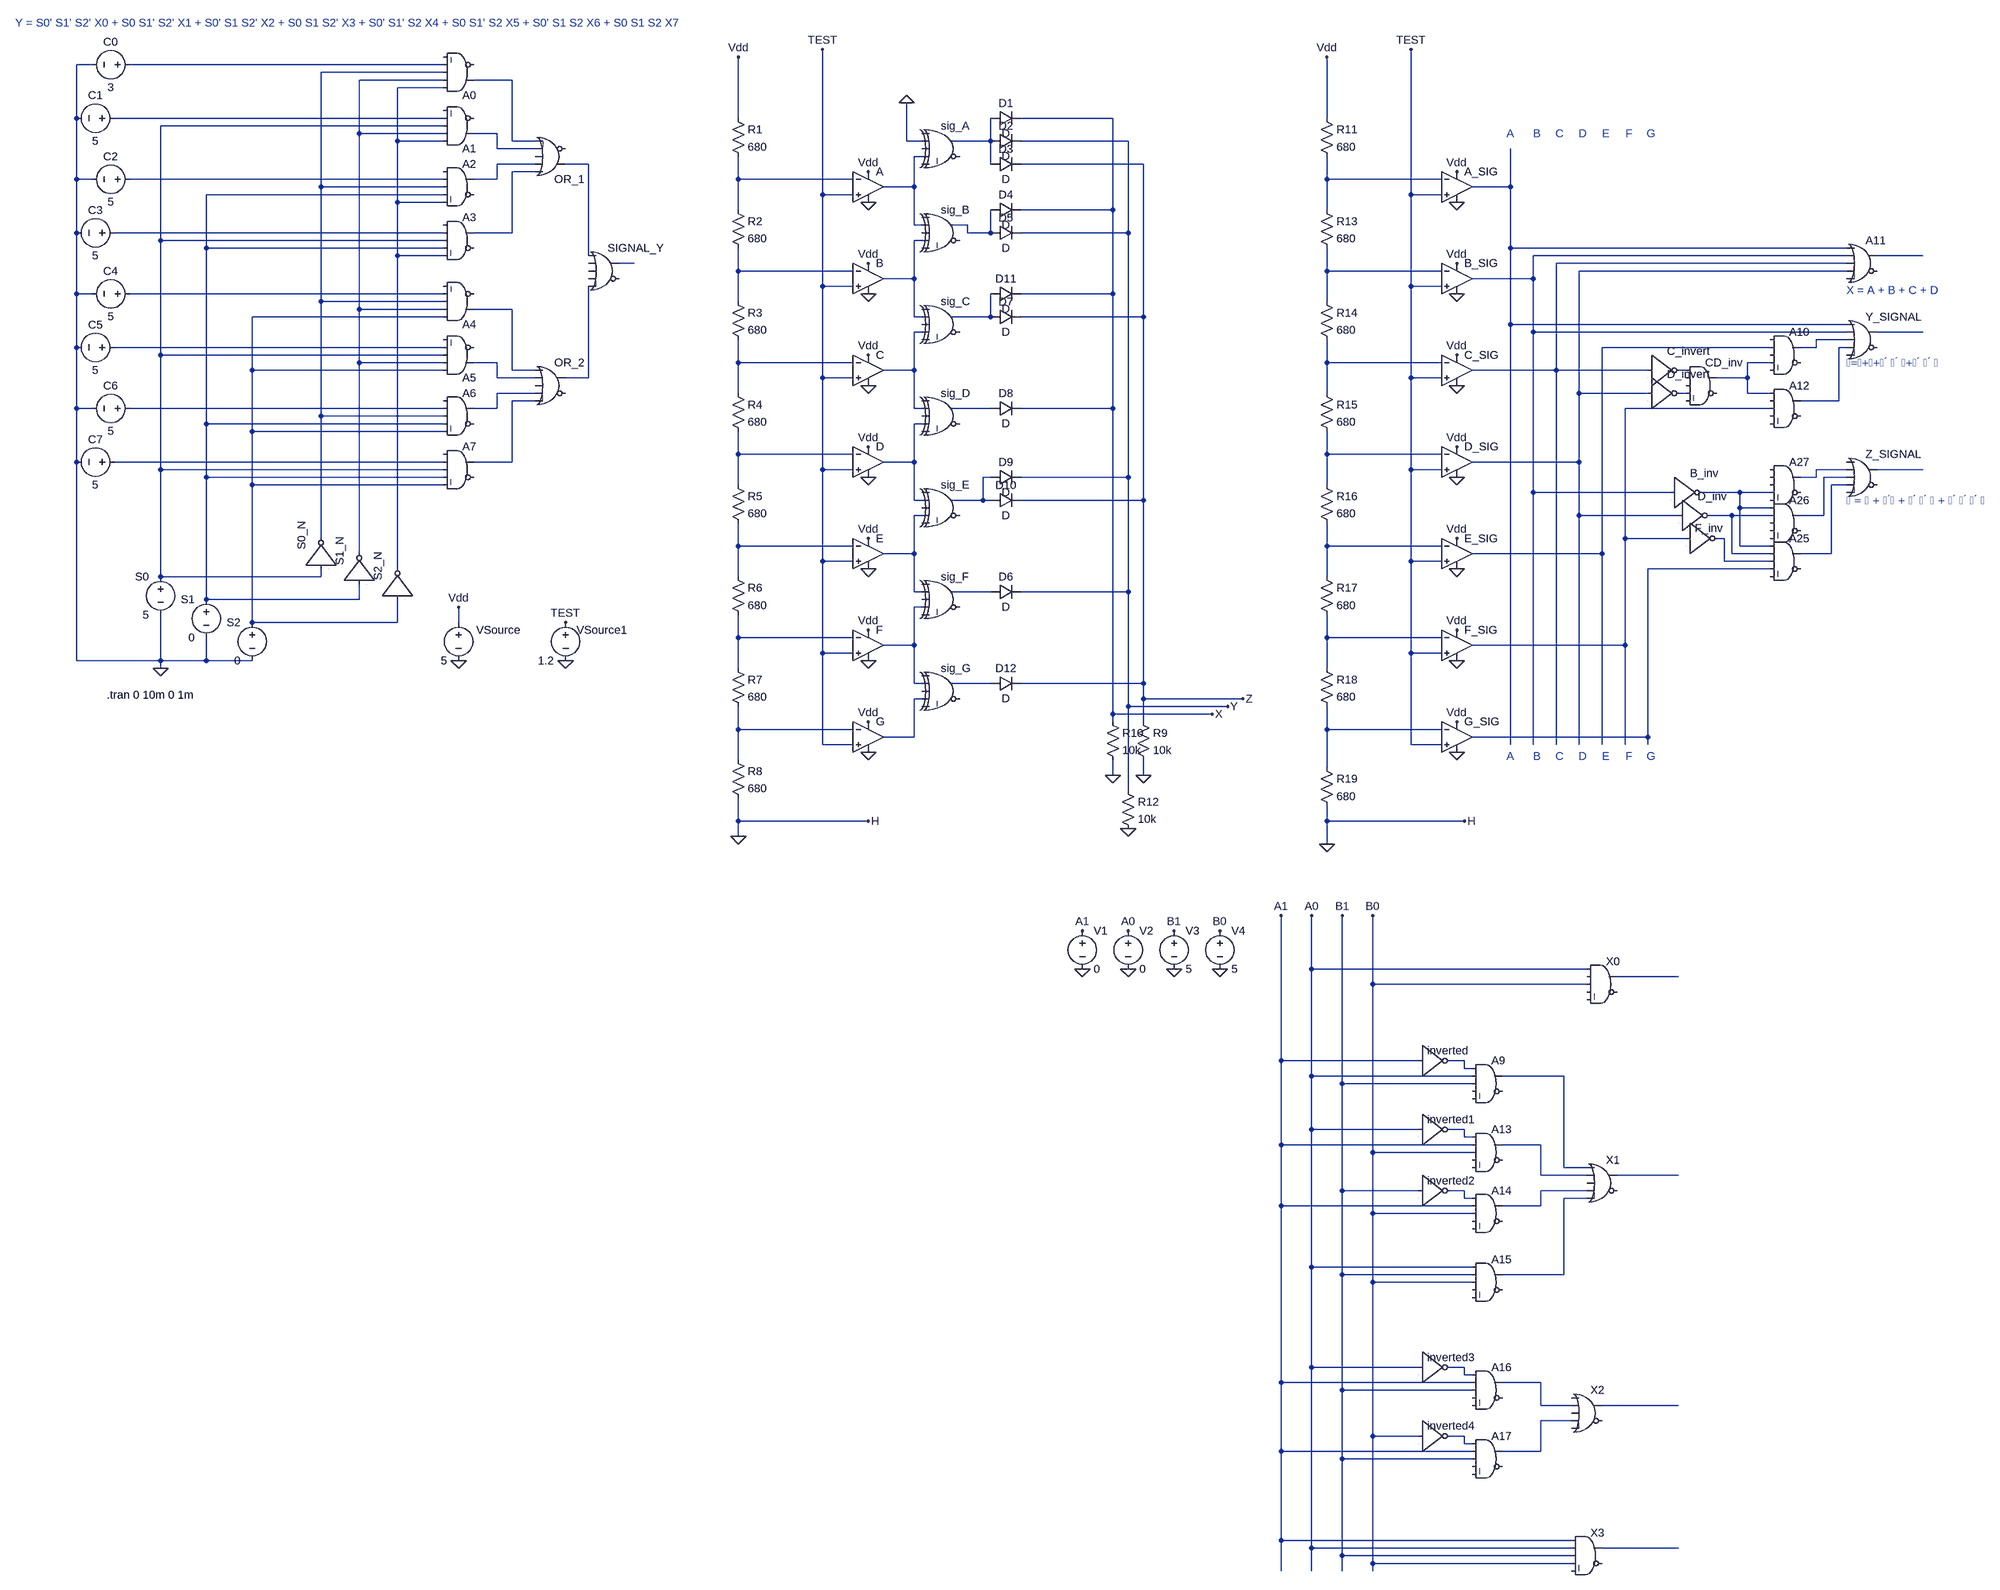
[diagram p0: schematic ALL SCHEMATICS.asc]
ALL SCHEMATICS.asc, the LTspice schematic file:
Version 4
SHEET 1 4152 3384
WIRE -512 48 -544 48
WIRE 224 48 -432 48
WIRE 224 64 -32 64
WIRE 224 80 48 80
WIRE 368 80 288 80
WIRE 224 96 128 96
WIRE -544 160 -544 48
WIRE 224 160 -464 160
WIRE 880 160 880 32
WIRE 1664 160 1472 160
WIRE 2112 160 2112 32
WIRE 224 176 -368 176
WIRE 48 192 48 80
WIRE 224 192 48 192
WIRE 336 192 288 192
WIRE 128 208 128 96
WIRE 224 208 128 208
WIRE 368 208 368 80
WIRE 416 208 368 208
WIRE 1232 208 1232 128
WIRE 1264 208 1232 208
WIRE 1408 208 1408 160
WIRE 1408 208 1328 208
WIRE 1696 208 1472 208
WIRE 336 224 336 192
WIRE 416 224 336 224
WIRE 1264 240 1248 240
WIRE 416 256 336 256
WIRE 528 256 480 256
WIRE 1408 256 1408 208
WIRE 1728 256 1472 256
WIRE 416 272 368 272
WIRE -544 288 -544 160
WIRE -512 288 -544 288
WIRE 224 288 -432 288
WIRE 336 288 336 256
WIRE 336 288 288 288
WIRE 880 288 880 240
WIRE 1120 288 880 288
WIRE 2112 288 2112 240
WIRE 2352 288 2112 288
WIRE -32 304 -32 64
WIRE 224 304 -32 304
WIRE 1248 304 1248 240
WIRE 1248 304 1184 304
WIRE 2496 304 2496 224
WIRE 2496 304 2416 304
WIRE 224 320 -272 320
WIRE 1056 320 1056 16
WIRE 1120 320 1056 320
WIRE 2288 320 2288 16
WIRE 2352 320 2288 320
WIRE 128 336 128 208
WIRE 224 336 128 336
WIRE 880 352 880 288
WIRE 1664 352 1664 160
WIRE 1664 352 1472 352
WIRE 2112 352 2112 288
WIRE 1248 384 1248 304
WIRE 1264 384 1248 384
WIRE 1360 384 1328 384
WIRE -544 400 -544 288
WIRE 224 400 -464 400
WIRE 368 400 368 272
WIRE 368 400 288 400
WIRE 1360 400 1360 384
WIRE 1408 400 1408 352
WIRE 1408 400 1360 400
WIRE 1696 400 1696 208
WIRE 1696 400 1472 400
WIRE -368 416 -368 176
WIRE 224 416 -368 416
WIRE 1264 416 1248 416
WIRE -272 432 -272 320
WIRE 224 432 -272 432
WIRE 2496 432 2496 304
WIRE 3200 432 2496 432
WIRE 128 448 128 336
WIRE 224 448 128 448
WIRE 528 448 528 256
WIRE 3200 448 2544 448
WIRE 3360 448 3264 448
WIRE 624 464 592 464
WIRE 3200 464 2592 464
WIRE 880 480 880 432
WIRE 1120 480 880 480
WIRE 2112 480 2112 432
WIRE 2352 480 2112 480
WIRE 3200 480 2640 480
WIRE 1248 496 1248 416
WIRE 1248 496 1184 496
WIRE 2544 496 2544 448
WIRE 2544 496 2416 496
WIRE 1056 512 1056 320
WIRE 1120 512 1056 512
WIRE 2288 512 2288 320
WIRE 2352 512 2288 512
WIRE -544 528 -544 400
WIRE -512 528 -544 528
WIRE 224 528 -432 528
WIRE 1664 528 1664 352
WIRE 1664 528 1472 528
WIRE -32 544 -32 304
WIRE 224 544 -32 544
WIRE 880 544 880 480
WIRE 2112 544 2112 480
WIRE 48 560 48 192
WIRE 224 560 48 560
WIRE 368 560 288 560
WIRE 224 576 -176 576
WIRE 1248 576 1248 496
WIRE 1264 576 1248 576
WIRE 1408 576 1408 528
WIRE 1408 576 1328 576
WIRE 1728 576 1728 256
WIRE 1728 576 1472 576
WIRE 2496 592 2496 432
WIRE 3200 592 2496 592
WIRE 1264 608 1248 608
WIRE 2544 608 2544 496
WIRE 3200 608 2544 608
WIRE 3360 608 3264 608
WIRE 3200 624 3136 624
WIRE -544 640 -544 528
WIRE 224 640 -464 640
WIRE 3040 640 2688 640
WIRE 3136 640 3136 624
WIRE 3136 640 3104 640
WIRE 3200 640 3184 640
WIRE -368 656 -368 416
WIRE 224 656 -368 656
WIRE 48 672 48 560
WIRE 224 672 48 672
WIRE 336 672 288 672
WIRE 880 672 880 624
WIRE 1120 672 880 672
WIRE 2112 672 2112 624
WIRE 2352 672 2112 672
WIRE 3040 672 2992 672
WIRE -176 688 -176 576
WIRE 224 688 -176 688
WIRE 368 688 368 560
WIRE 416 688 368 688
WIRE 1248 688 1248 608
WIRE 1248 688 1184 688
WIRE 2592 688 2592 464
WIRE 2592 688 2416 688
WIRE 2784 688 2592 688
WIRE 2864 688 2848 688
WIRE 336 704 336 672
WIRE 416 704 336 704
WIRE 528 704 528 512
WIRE 528 704 480 704
WIRE 1056 704 1056 512
WIRE 1120 704 1056 704
WIRE 2288 704 2288 512
WIRE 2352 704 2288 704
WIRE 2992 704 2992 672
WIRE 2992 704 2928 704
WIRE 416 736 336 736
WIRE 880 736 880 672
WIRE 2112 736 2112 672
WIRE 2640 736 2640 480
WIRE 2784 736 2640 736
WIRE 2864 736 2848 736
WIRE 2992 736 2992 704
WIRE 3040 736 2992 736
WIRE 416 752 368 752
WIRE 3184 752 3184 640
WIRE 3184 752 3104 752
WIRE -544 768 -544 640
WIRE -512 768 -544 768
WIRE 224 768 -432 768
WIRE 336 768 336 736
WIRE 336 768 288 768
WIRE 1248 768 1248 688
WIRE 1264 768 1248 768
WIRE 1408 768 1328 768
WIRE 1664 768 1664 528
WIRE 1664 768 1472 768
WIRE 3040 768 2736 768
WIRE -32 784 -32 544
WIRE 224 784 -32 784
WIRE -272 800 -272 432
WIRE 224 800 -272 800
WIRE 1264 800 1248 800
WIRE -176 816 -176 688
WIRE 224 816 -176 816
WIRE 880 864 880 816
WIRE 1120 864 880 864
WIRE 2112 864 2112 816
WIRE 2352 864 2112 864
WIRE -544 880 -544 768
WIRE 224 880 -464 880
WIRE 368 880 368 752
WIRE 368 880 288 880
WIRE 1248 880 1248 800
WIRE 1248 880 1184 880
WIRE 2640 880 2640 736
WIRE 2640 880 2416 880
WIRE -368 896 -368 656
WIRE 224 896 -368 896
WIRE 1056 896 1056 704
WIRE 1120 896 1056 896
WIRE 2288 896 2288 704
WIRE 2352 896 2288 896
WIRE 3200 896 3136 896
WIRE 3360 896 3264 896
WIRE -272 912 -272 800
WIRE 224 912 -272 912
WIRE 1408 912 1392 912
WIRE 1696 912 1696 400
WIRE 1696 912 1472 912
WIRE 3136 912 3136 896
WIRE 3136 912 3104 912
WIRE 3200 912 3152 912
WIRE -176 928 -176 816
WIRE 224 928 -176 928
WIRE 880 928 880 864
WIRE 2112 928 2112 864
WIRE 3200 928 3168 928
WIRE 2544 944 2544 608
WIRE 2832 944 2544 944
WIRE 2976 944 2896 944
WIRE 3040 944 2976 944
WIRE 1248 960 1248 880
WIRE 1264 960 1248 960
WIRE 1392 960 1392 912
WIRE 1392 960 1328 960
WIRE 1408 960 1392 960
WIRE 1728 960 1728 576
WIRE 1728 960 1472 960
WIRE 2976 976 2976 944
WIRE 3040 976 2976 976
WIRE 1264 992 1248 992
WIRE 2640 992 2640 880
WIRE 2848 992 2640 992
WIRE 2960 992 2912 992
WIRE 3040 992 2960 992
WIRE 3152 992 3152 912
WIRE 3152 992 3104 992
WIRE -32 1040 -32 784
WIRE 2736 1040 2736 768
WIRE 2864 1040 2736 1040
WIRE 2944 1040 2928 1040
WIRE 880 1056 880 1008
WIRE 1120 1056 880 1056
WIRE 2112 1056 2112 1008
WIRE 2352 1056 2112 1056
WIRE 2976 1056 2976 976
WIRE 3040 1056 2976 1056
WIRE 48 1072 48 672
WIRE 1248 1072 1248 992
WIRE 1248 1072 1184 1072
WIRE 2688 1072 2688 640
WIRE 2688 1072 2416 1072
WIRE 2960 1072 2960 992
WIRE 3040 1072 2960 1072
WIRE 3168 1072 3168 928
WIRE 3168 1072 3104 1072
WIRE 1056 1088 1056 896
WIRE 1120 1088 1056 1088
WIRE 2288 1088 2288 896
WIRE 2352 1088 2288 1088
WIRE 2944 1088 2944 1040
WIRE 3040 1088 2944 1088
WIRE 128 1104 128 448
WIRE 3040 1104 2784 1104
WIRE -368 1120 -368 896
WIRE -32 1120 -32 1104
WIRE -32 1120 -368 1120
WIRE 880 1120 880 1056
WIRE 2112 1120 2112 1056
WIRE 1248 1152 1248 1072
WIRE 1264 1152 1248 1152
WIRE 1408 1152 1328 1152
WIRE 1696 1152 1696 912
WIRE 1696 1152 1472 1152
WIRE -272 1168 -272 912
WIRE 48 1168 48 1136
WIRE 48 1168 -272 1168
WIRE 1264 1184 1248 1184
WIRE -176 1216 -176 928
WIRE 128 1216 128 1168
WIRE 128 1216 -176 1216
WIRE 256 1216 256 1184
WIRE 880 1248 880 1200
WIRE 1120 1248 880 1248
WIRE 2112 1248 2112 1200
WIRE 2352 1248 2112 1248
WIRE 1248 1264 1248 1184
WIRE 1248 1264 1184 1264
WIRE 2736 1264 2736 1040
WIRE 2736 1264 2416 1264
WIRE 1056 1280 1056 1088
WIRE 1120 1280 1056 1280
WIRE 2288 1280 2288 1088
WIRE 2352 1280 2288 1280
WIRE -544 1296 -544 880
WIRE -368 1296 -368 1200
WIRE -368 1296 -544 1296
WIRE -272 1296 -272 1248
WIRE -272 1296 -368 1296
WIRE -176 1296 -272 1296
WIRE -368 1312 -368 1296
WIRE 880 1312 880 1248
WIRE 2112 1312 2112 1248
WIRE 1248 1344 1248 1264
WIRE 1264 1344 1248 1344
WIRE 1408 1344 1328 1344
WIRE 1728 1344 1728 960
WIRE 1728 1344 1472 1344
WIRE 1264 1376 1248 1376
WIRE 1728 1376 1728 1344
WIRE 1936 1376 1728 1376
WIRE 1696 1392 1696 1152
WIRE 1904 1392 1696 1392
WIRE 1664 1408 1664 768
WIRE 1872 1408 1664 1408
WIRE 1664 1424 1664 1408
WIRE 1728 1424 1728 1376
WIRE 880 1440 880 1392
WIRE 1120 1440 880 1440
WIRE 2112 1440 2112 1392
WIRE 2352 1440 2112 1440
WIRE 1248 1456 1248 1376
WIRE 1248 1456 1184 1456
WIRE 2784 1456 2784 1104
WIRE 2784 1456 2416 1456
WIRE 1056 1472 1056 1280
WIRE 1120 1472 1056 1472
WIRE 2288 1472 2288 1280
WIRE 2352 1472 2288 1472
WIRE 2496 1472 2496 592
WIRE 2544 1472 2544 944
WIRE 2592 1472 2592 688
WIRE 2640 1472 2640 992
WIRE 2688 1472 2688 1072
WIRE 2736 1472 2736 1264
WIRE 2784 1472 2784 1456
WIRE 880 1504 880 1440
WIRE 2112 1520 2112 1440
WIRE 1664 1536 1664 1504
WIRE 1728 1536 1728 1504
WIRE 1696 1568 1696 1392
WIRE 880 1632 880 1584
WIRE 1152 1632 880 1632
WIRE 2112 1632 2112 1600
WIRE 2400 1632 2112 1632
WIRE 880 1664 880 1632
WIRE 2112 1680 2112 1632
WIRE 2080 2032 2080 1920
WIRE 2656 2032 2080 2032
WIRE 2848 2048 2720 2048
WIRE 2208 2064 2208 1920
WIRE 2656 2064 2208 2064
WIRE 2016 2224 2016 1920
WIRE 2304 2224 2016 2224
WIRE 2400 2224 2368 2224
WIRE 2400 2240 2400 2224
WIRE 2416 2240 2400 2240
WIRE 2080 2256 2080 2032
WIRE 2416 2256 2080 2256
WIRE 2608 2256 2480 2256
WIRE 2144 2272 2144 1920
WIRE 2416 2272 2144 2272
WIRE 2080 2368 2080 2256
WIRE 2304 2368 2080 2368
WIRE 2400 2368 2368 2368
WIRE 2400 2384 2400 2368
WIRE 2416 2384 2400 2384
WIRE 2016 2400 2016 2224
WIRE 2416 2400 2016 2400
WIRE 2560 2400 2480 2400
WIRE 2208 2416 2208 2064
WIRE 2416 2416 2208 2416
WIRE 2608 2448 2608 2256
WIRE 2656 2448 2608 2448
WIRE 2560 2464 2560 2400
WIRE 2656 2464 2560 2464
WIRE 2848 2464 2720 2464
WIRE 2144 2496 2144 2272
WIRE 2304 2496 2144 2496
WIRE 2400 2496 2368 2496
WIRE 2656 2496 2560 2496
WIRE 2400 2512 2400 2496
WIRE 2416 2512 2400 2512
WIRE 2656 2512 2608 2512
WIRE 2016 2528 2016 2400
WIRE 2416 2528 2016 2528
WIRE 2560 2528 2560 2496
WIRE 2560 2528 2480 2528
WIRE 2208 2544 2208 2416
WIRE 2416 2544 2208 2544
WIRE 2080 2656 2080 2368
WIRE 2416 2656 2080 2656
WIRE 2144 2672 2144 2496
WIRE 2416 2672 2144 2672
WIRE 2608 2672 2608 2512
WIRE 2608 2672 2480 2672
WIRE 2208 2688 2208 2544
WIRE 2416 2688 2208 2688
WIRE 2080 2896 2080 2656
WIRE 2304 2896 2080 2896
WIRE 2400 2896 2368 2896
WIRE 2400 2912 2400 2896
WIRE 2416 2912 2400 2912
WIRE 2016 2928 2016 2528
WIRE 2416 2928 2016 2928
WIRE 2560 2928 2480 2928
WIRE 2144 2944 2144 2672
WIRE 2416 2944 2144 2944
WIRE 2560 2976 2560 2928
WIRE 2624 2976 2560 2976
WIRE 2848 2976 2688 2976
WIRE 2624 3008 2560 3008
WIRE 2208 3040 2208 2688
WIRE 2304 3040 2208 3040
WIRE 2400 3040 2368 3040
WIRE 2400 3056 2400 3040
WIRE 2416 3056 2400 3056
WIRE 2016 3072 2016 2928
WIRE 2416 3072 2016 3072
WIRE 2560 3072 2560 3008
WIRE 2560 3072 2480 3072
WIRE 2144 3088 2144 2944
WIRE 2416 3088 2144 3088
WIRE 2016 3312 2016 3072
WIRE 2624 3312 2016 3312
WIRE 2080 3328 2080 2896
WIRE 2624 3328 2080 3328
WIRE 2848 3328 2688 3328
WIRE 2144 3344 2144 3088
WIRE 2624 3344 2144 3344
WIRE 2208 3360 2208 3040
WIRE 2624 3360 2208 3360
WIRE 2016 3376 2016 3312
WIRE 2080 3376 2080 3328
WIRE 2144 3376 2144 3344
WIRE 2208 3376 2208 3360
FLAG -368 1312 0
FLAG 880 32 Vdd
FLAG 1152 464 Vdd
FLAG 1152 272 Vdd
FLAG 1152 656 Vdd
FLAG 1152 848 Vdd
FLAG 1152 1040 Vdd
FLAG 1152 1232 Vdd
FLAG 1152 1424 Vdd
FLAG 1152 1488 0
FLAG 1152 1296 0
FLAG 1152 1104 0
FLAG 1152 912 0
FLAG 1152 720 0
FLAG 1152 528 0
FLAG 1152 336 0
FLAG 880 1664 0
FLAG 256 1184 Vdd
FLAG 256 1296 0
FLAG 480 1216 TEST
FLAG 1056 16 TEST
FLAG 1232 128 0
FLAG 480 1296 0
FLAG 1664 1536 0
FLAG 1728 1536 0
FLAG 1696 1648 0
FLAG 1936 1376 Z
FLAG 1904 1392 Y
FLAG 1872 1408 X
FLAG 2112 32 Vdd
FLAG 2384 464 Vdd
FLAG 2384 272 Vdd
FLAG 2384 656 Vdd
FLAG 2384 848 Vdd
FLAG 2384 1040 Vdd
FLAG 2384 1232 Vdd
FLAG 2384 1424 Vdd
FLAG 2384 1488 0
FLAG 2384 1296 0
FLAG 2384 1104 0
FLAG 2384 912 0
FLAG 2384 720 0
FLAG 2384 528 0
FLAG 2384 336 0
FLAG 2112 1680 0
FLAG 2288 16 TEST
FLAG 1152 1632 H
FLAG 2400 1632 H
FLAG 2016 1920 A1
FLAG 2080 1920 A0
FLAG 2144 1920 B1
FLAG 2208 1920 B0
FLAG 1888 2032 0
FLAG 1792 2032 0
FLAG 1696 2032 0
FLAG 1600 2032 0
FLAG 1600 1952 A1
FLAG 1696 1952 A0
FLAG 1792 1952 B1
FLAG 1888 1952 B0
SYMBOL Digital\\and 256 240 M180
SYMATTR InstName A1
SYMATTR SpiceLine vhigh=5
SYMBOL Digital\\and 256 128 M180
SYMATTR InstName A0
SYMATTR SpiceLine vhigh=5
SYMBOL Digital\\and 256 240 R0
SYMATTR InstName A2
SYMATTR SpiceLine vhigh=5
SYMBOL Digital\\and 256 352 R0
SYMATTR InstName A3
SYMATTR SpiceLine vhigh=5
SYMBOL Digital\\and 256 608 M180
SYMATTR InstName A4
SYMATTR SpiceLine vhigh=5
SYMBOL Digital\\and 256 720 M180
SYMATTR InstName A5
SYMATTR SpiceLine vhigh=5
SYMBOL Digital\\and 256 720 R0
SYMATTR InstName A6
SYMATTR SpiceLine vhigh=5
SYMBOL Digital\\and 256 832 R0
SYMATTR InstName A7
SYMATTR SpiceLine vhigh=5
SYMBOL Digital\\or 448 656 R0
SYMATTR InstName OR_2
SYMATTR SpiceLine vhigh=5
SYMBOL Digital\\or 448 304 M180
SYMATTR InstName OR_1
SYMATTR SpiceLine vhigh=5
SYMBOL Digital\\inv -96 1104 R270
SYMATTR InstName S0_N
SYMATTR SpiceLine vhigh=5
SYMBOL Digital\\inv -16 1136 R270
SYMATTR InstName S1_N
SYMATTR SpiceLine vhigh=5
SYMBOL Digital\\inv 64 1168 R270
SYMATTR InstName S2_N
SYMATTR SpiceLine vhigh=5
SYMBOL voltage -368 1104 M0
SYMATTR InstName S0
SYMATTR Value 5
SYMBOL voltage -272 1152 M0
SYMATTR InstName S1
SYMATTR Value 0
SYMBOL voltage -176 1200 M0
SYMATTR InstName S2
SYMATTR Value 0
SYMBOL voltage -416 48 R90
WINDOW 0 -32 56 VBottom 2
WINDOW 3 32 56 VTop 2
SYMATTR InstName C0
SYMATTR Value 3
SYMBOL voltage -448 160 R90
WINDOW 0 -32 56 VBottom 2
WINDOW 3 32 56 VTop 2
SYMATTR InstName C1
SYMATTR Value 5
SYMBOL voltage -416 288 R90
WINDOW 0 -32 56 VBottom 2
WINDOW 3 32 56 VTop 2
SYMATTR InstName C2
SYMATTR Value 5
SYMBOL voltage -448 400 R90
WINDOW 0 -32 56 VBottom 2
WINDOW 3 32 56 VTop 2
SYMATTR InstName C3
SYMATTR Value 5
SYMBOL voltage -416 528 R90
WINDOW 0 -32 56 VBottom 2
WINDOW 3 32 56 VTop 2
SYMATTR InstName C4
SYMATTR Value 5
SYMBOL voltage -448 640 R90
WINDOW 0 -32 56 VBottom 2
WINDOW 3 32 56 VTop 2
SYMATTR InstName C5
SYMATTR Value 5
SYMBOL voltage -416 768 R90
WINDOW 0 -32 56 VBottom 2
WINDOW 3 32 56 VTop 2
SYMATTR InstName C6
SYMATTR Value 5
SYMBOL voltage -448 880 R90
WINDOW 0 -32 56 VBottom 2
WINDOW 3 32 56 VTop 2
SYMATTR InstName C7
SYMATTR Value 5
SYMBOL res 864 144 R0
SYMATTR InstName R1
SYMATTR Value 680
SYMBOL res 864 336 R0
SYMATTR InstName R2
SYMATTR Value 680
SYMBOL res 864 528 R0
SYMATTR InstName R3
SYMATTR Value 680
SYMBOL res 864 720 R0
SYMATTR InstName R4
SYMATTR Value 680
SYMBOL res 864 912 R0
SYMATTR InstName R5
SYMATTR Value 680
SYMBOL res 864 1104 R0
SYMATTR InstName R6
SYMATTR Value 680
SYMBOL res 864 1296 R0
SYMATTR InstName R7
SYMATTR Value 680
SYMBOL res 864 1488 R0
SYMATTR InstName R8
SYMATTR Value 680
SYMBOL OpAmps\\UniversalOpamp2 1152 304 R0
SYMATTR InstName A
SYMBOL OpAmps\\UniversalOpamp2 1152 496 R0
SYMATTR InstName B
SYMBOL OpAmps\\UniversalOpamp2 1152 688 R0
SYMATTR InstName C
SYMBOL OpAmps\\UniversalOpamp2 1152 880 R0
SYMATTR InstName D
SYMBOL OpAmps\\UniversalOpamp2 1152 1072 R0
SYMATTR InstName E
SYMBOL OpAmps\\UniversalOpamp2 1152 1264 R0
SYMATTR InstName F
SYMBOL OpAmps\\UniversalOpamp2 1152 1456 R0
SYMATTR InstName G
SYMBOL voltage 256 1200 M0
WINDOW 0 -129 32 Left 2
SYMATTR InstName VSource
SYMATTR Value 5
SYMBOL voltage 480 1200 M0
WINDOW 0 -129 32 Left 2
WINDOW 123 0 0 Left 0
WINDOW 39 0 0 Left 0
SYMATTR InstName VSource1
SYMATTR Value 1.2
SYMBOL Digital\\or 560 416 R0
SYMATTR InstName SIGNAL_Y
SYMATTR SpiceLine vhigh=5
SYMBOL Digital\\xor 1312 160 R0
SYMATTR InstName sig_A
SYMATTR SpiceLine vhigh=5
SYMBOL Digital\\xor 1312 336 R0
SYMATTR InstName sig_B
SYMATTR SpiceLine vhigh=5
SYMBOL Digital\\xor 1312 528 R0
SYMATTR InstName sig_C
SYMATTR SpiceLine vhigh=5
SYMBOL Digital\\xor 1312 720 R0
SYMATTR InstName sig_D
SYMATTR SpiceLine vhigh=5
SYMBOL Digital\\xor 1312 912 R0
SYMATTR InstName sig_E
SYMATTR SpiceLine vhigh=5
SYMBOL Digital\\xor 1312 1104 R0
SYMATTR InstName sig_F
SYMATTR SpiceLine vhigh=5
SYMBOL Digital\\xor 1312 1296 R0
SYMATTR InstName sig_G
SYMATTR SpiceLine vhigh=5
SYMBOL diode 1408 224 R270
WINDOW 0 32 32 VTop 2
WINDOW 3 0 32 VBottom 2
SYMATTR InstName D2
SYMBOL diode 1408 176 R270
WINDOW 0 32 32 VTop 2
WINDOW 3 0 32 VBottom 2
SYMATTR InstName D1
SYMBOL diode 1408 272 R270
WINDOW 0 32 32 VTop 2
WINDOW 3 0 32 VBottom 2
SYMATTR InstName D3
SYMBOL diode 1408 368 R270
WINDOW 0 32 32 VTop 2
WINDOW 3 0 32 VBottom 2
SYMATTR InstName D4
SYMBOL diode 1408 416 R270
WINDOW 0 32 32 VTop 2
WINDOW 3 0 32 VBottom 2
SYMATTR InstName D5
SYMBOL diode 1408 592 R270
WINDOW 0 32 32 VTop 2
WINDOW 3 0 32 VBottom 2
SYMATTR InstName D7
SYMBOL diode 1408 784 R270
WINDOW 0 32 32 VTop 2
WINDOW 3 0 32 VBottom 2
SYMATTR InstName D8
SYMBOL diode 1408 976 R270
WINDOW 0 32 32 VTop 2
WINDOW 3 0 32 VBottom 2
SYMATTR InstName D10
SYMBOL diode 1408 928 R270
WINDOW 0 32 32 VTop 2
WINDOW 3 0 32 VBottom 2
SYMATTR InstName D9
SYMBOL diode 1408 544 R270
WINDOW 0 32 32 VTop 2
WINDOW 3 0 32 VBottom 2
SYMATTR InstName D11
SYMBOL diode 1408 1168 R270
WINDOW 0 32 32 VTop 2
WINDOW 3 0 32 VBottom 2
SYMATTR InstName D6
SYMBOL diode 1408 1360 R270
WINDOW 0 32 32 VTop 2
WINDOW 3 0 32 VBottom 2
SYMATTR InstName D12
SYMBOL res 1712 1408 R0
SYMATTR InstName R9
SYMATTR Value 10k
SYMBOL res 1648 1408 R0
SYMATTR InstName R10
SYMATTR Value 10k
SYMBOL res 1680 1552 R0
SYMATTR InstName R12
SYMATTR Value 10k
SYMBOL res 2096 144 R0
SYMATTR InstName R11
SYMATTR Value 680
SYMBOL res 2096 336 R0
SYMATTR InstName R13
SYMATTR Value 680
SYMBOL res 2096 528 R0
SYMATTR InstName R14
SYMATTR Value 680
SYMBOL res 2096 720 R0
SYMATTR InstName R15
SYMATTR Value 680
SYMBOL res 2096 912 R0
SYMATTR InstName R16
SYMATTR Value 680
SYMBOL res 2096 1104 R0
SYMATTR InstName R17
SYMATTR Value 680
SYMBOL res 2096 1296 R0
SYMATTR InstName R18
SYMATTR Value 680
SYMBOL res 2096 1504 R0
SYMATTR InstName R19
SYMATTR Value 680
SYMBOL OpAmps\\UniversalOpamp2 2384 304 R0
SYMATTR InstName A_SIG
SYMBOL OpAmps\\UniversalOpamp2 2384 496 R0
SYMATTR InstName B_SIG
SYMBOL OpAmps\\UniversalOpamp2 2384 688 R0
SYMATTR InstName C_SIG
SYMBOL OpAmps\\UniversalOpamp2 2384 880 R0
SYMATTR InstName D_SIG
SYMBOL OpAmps\\UniversalOpamp2 2384 1072 R0
SYMATTR InstName E_SIG
SYMBOL OpAmps\\UniversalOpamp2 2384 1264 R0
SYMATTR InstName F_SIG
SYMBOL OpAmps\\UniversalOpamp2 2384 1456 R0
SYMATTR InstName G_SIG
SYMBOL Digital\\or 3232 400 R0
SYMATTR InstName A11
SYMATTR SpiceLine vhigh=5
SYMBOL Digital\\or 3232 560 R0
SYMATTR InstName Y_SIGNAL
SYMATTR SpiceLine vhigh=5
SYMBOL Digital\\or 3232 848 R0
SYMATTR InstName Z_SIGNAL
SYMATTR SpiceLine vhigh=5
SYMBOL Digital\\inv 2784 624 R0
SYMATTR InstName C_invert
SYMATTR SpiceLine vhigh=5
SYMBOL Digital\\inv 2784 672 R0
SYMATTR InstName D_invert
SYMATTR SpiceLine vhigh=5
SYMBOL Digital\\and 3072 592 R0
SYMATTR InstName A10
SYMATTR SpiceLine vhigh=5
SYMBOL Digital\\and 3072 704 R0
SYMATTR InstName A12
SYMATTR SpiceLine vhigh=5
SYMBOL Digital\\inv 2832 880 R0
SYMATTR InstName B_inv
SYMATTR SpiceLine vhigh=5
SYMBOL Digital\\inv 2848 928 R0
SYMATTR InstName D_inv
SYMATTR SpiceLine vhigh=5
SYMBOL Digital\\inv 2864 976 R0
WINDOW 0 18 43 Left 2
SYMATTR InstName F_inv
SYMATTR SpiceLine vhigh=5
SYMBOL Digital\\and 3072 1024 R0
SYMATTR InstName A25
SYMATTR SpiceLine vhigh=5
SYMBOL Digital\\and 3072 944 R0
SYMATTR InstName A26
SYMATTR SpiceLine vhigh=5
SYMBOL Digital\\and 3072 864 R0
SYMATTR InstName A27
SYMATTR SpiceLine vhigh=5
SYMBOL Digital\\and 2896 656 R0
SYMATTR InstName CD_inv
SYMATTR SpiceLine vhigh=5
SYMBOL Digital\\and 2688 2000 R0
SYMATTR InstName X0
SYMATTR SpiceLine vhigh=5
SYMBOL Digital\\and 2448 2208 R0
SYMATTR InstName A9
SYMATTR SpiceLine vhigh=5
SYMBOL Digital\\and 2448 2352 R0
SYMATTR InstName A13
SYMATTR SpiceLine vhigh=5
SYMBOL Digital\\and 2448 2480 R0
SYMATTR InstName A14
SYMATTR SpiceLine vhigh=5
SYMBOL Digital\\and 2448 2624 R0
SYMATTR InstName A15
SYMATTR SpiceLine vhigh=5
SYMBOL Digital\\and 2448 2880 R0
SYMATTR InstName A16
SYMATTR SpiceLine vhigh=5
SYMBOL Digital\\and 2448 3024 R0
SYMATTR InstName A17
SYMATTR SpiceLine vhigh=5
SYMBOL Digital\\and 2656 3280 R0
SYMATTR InstName X3
SYMATTR SpiceLine vhigh=5
SYMBOL Digital\\or 2688 2416 R0
SYMATTR InstName X1
SYMATTR SpiceLine vhigh=5
SYMBOL Digital\\or 2656 2928 R0
SYMATTR InstName X2
SYMATTR SpiceLine vhigh=5
SYMBOL Digital\\inv 2304 2160 R0
WINDOW 0 18 43 Left 2
SYMATTR InstName inverted
SYMATTR SpiceLine vhigh=5
SYMBOL Digital\\inv 2304 2304 R0
WINDOW 0 18 43 Left 2
SYMATTR InstName inverted1
SYMATTR SpiceLine vhigh=5
SYMBOL Digital\\inv 2304 2432 R0
WINDOW 0 18 43 Left 2
SYMATTR InstName inverted2
SYMATTR SpiceLine vhigh=5
SYMBOL Digital\\inv 2304 2832 R0
WINDOW 0 18 43 Left 2
SYMATTR InstName inverted3
SYMATTR SpiceLine vhigh=5
SYMBOL Digital\\inv 2304 2976 R0
WINDOW 0 18 43 Left 2
SYMATTR InstName inverted4
SYMATTR SpiceLine vhigh=5
SYMBOL voltage 1600 1936 R0
SYMATTR InstName V1
SYMATTR Value 0
SYMBOL voltage 1696 1936 R0
SYMATTR InstName V2
SYMATTR Value 0
SYMBOL voltage 1792 1936 R0
SYMATTR InstName V3
SYMATTR Value 5
SYMBOL voltage 1888 1936 R0
SYMATTR InstName V4
SYMATTR Value 5
TEXT -480 1368 Left 2 !.tran 0 10m 0 1m
TEXT -672 -40 Left 2 ;Y = S0' S1' S2' X0 + S0 S1' S2' X1 + S0' S1 S2' X2 + S0 S1 S2' X3 + S0' S1' S2 X4 + S0 S1' S2 X5 + S0' S1 S2 X6 + S0 S1 S2 X7
TEXT 3200 960 Left 2 ;𝑍 = 𝐴 + 𝐵′𝐶 + 𝐵′ 𝐷′ 𝐸 + 𝐵′ 𝐷′ 𝐹′ 𝐺
TEXT 3200 672 Left 2 ;𝑌=𝐴+𝐵+𝐶′ 𝐷′ 𝐸+𝐶′ 𝐷′ 𝐹
TEXT 3200 520 Left 2 ;X = A + B + C + D
TEXT 2504 192 Right 2 ;A
TEXT 2560 192 Right 2 ;B
TEXT 2608 192 Right 2 ;C
TEXT 2656 192 Right 2 ;D
TEXT 2704 192 Right 2 ;E
TEXT 2752 192 Right 2 ;F
TEXT 2800 192 Right 2 ;G
TEXT 2504 1496 Right 2 ;A
TEXT 2560 1496 Right 2 ;B
TEXT 2608 1496 Right 2 ;C
TEXT 2656 1496 Right 2 ;D
TEXT 2704 1496 Right 2 ;E
TEXT 2752 1496 Right 2 ;F
TEXT 2800 1496 Right 2 ;G

The netlist it stands for:
* ALL SCHEMATICS.asc
A1 N005 N003 N007 N006 0 0 N008 0 AND vhigh=5
A0 N005 N003 N002 N001 0 0 N004 0 AND vhigh=5
A2 0 N014 N002 N018 N005 0 N011 0 AND vhigh=5
A3 0 N020 N007 N018 N005 0 N013 0 AND vhigh=5
A4 N031 N003 N002 N029 0 0 N030 0 AND vhigh=5
A5 N031 N003 N007 N036 0 0 N039 0 AND vhigh=5
A6 0 N048 N002 N018 N031 0 N045 0 AND vhigh=5
A7 0 N054 N007 N018 N031 0 N047 0 AND vhigh=5
A§OR_2 N030 N039 0 N045 N047 0 N044 0 OR vhigh=5
A§OR_1 N013 N011 0 N008 N004 0 N012 0 OR vhigh=5
A§S0_N N007 0 0 0 0 N002 0 0 BUF vhigh=5
A§S1_N N018 0 0 0 0 N003 0 0 BUF vhigh=5
A§S2_N N031 0 0 0 0 N005 0 0 BUF vhigh=5
V§S0 N007 0 5
V§S1 N018 0 0
V§S2 N031 0 0
V§C0 N001 0 3
V§C1 N006 0 5
V§C2 N014 0 5
V§C3 N020 0 5
V§C4 N029 0 5
V§C5 N036 0 5
V§C6 N048 0 5
V§C7 N054 0 5
R1 Vdd N015 680
R2 N015 N026 680
R3 N026 N040 680
R4 N040 N052 680
R5 N052 N064 680
R6 N064 N069 680
R7 N069 N073 680
R8 N073 0 680
XA TEST N015 Vdd 0 N010 level.2 Avol=1Meg GBW=10Meg Slew=10Meg ilimit=25m rail=0 Vos=0 phimargin=45 en=0 enk=0 in=0 ink=0 Rin=500Meg  ; pins IN+ IN- V+ V- OUT
XB TEST N026 Vdd 0 N021 level.2 Avol=1Meg GBW=10Meg Slew=10Meg ilimit=25m rail=0 Vos=0 phimargin=45 en=0 enk=0 in=0 ink=0 Rin=500Meg  ; pins IN+ IN- V+ V- OUT
XC TEST N040 Vdd 0 N033 level.2 Avol=1Meg GBW=10Meg Slew=10Meg ilimit=25m rail=0 Vos=0 phimargin=45 en=0 enk=0 in=0 ink=0 Rin=500Meg  ; pins IN+ IN- V+ V- OUT
XD TEST N052 Vdd 0 N051 level.2 Avol=1Meg GBW=10Meg Slew=10Meg ilimit=25m rail=0 Vos=0 phimargin=45 en=0 enk=0 in=0 ink=0 Rin=500Meg  ; pins IN+ IN- V+ V- OUT
XE TEST N064 Vdd 0 N061 level.2 Avol=1Meg GBW=10Meg Slew=10Meg ilimit=25m rail=0 Vos=0 phimargin=45 en=0 enk=0 in=0 ink=0 Rin=500Meg  ; pins IN+ IN- V+ V- OUT
XF TEST N069 Vdd 0 N068 level.2 Avol=1Meg GBW=10Meg Slew=10Meg ilimit=25m rail=0 Vos=0 phimargin=45 en=0 enk=0 in=0 ink=0 Rin=500Meg  ; pins IN+ IN- V+ V- OUT
XG TEST N073 Vdd 0 N072 level.2 Avol=1Meg GBW=10Meg Slew=10Meg ilimit=25m rail=0 Vos=0 phimargin=45 en=0 enk=0 in=0 ink=0 Rin=500Meg  ; pins IN+ IN- V+ V- OUT
VSource Vdd 0 5
VSource1 TEST 0 1.2
A§SIGNAL_Y N012 0 0 0 N044 0 N024 0 OR vhigh=5
A§sig_A 0 0 0 N010 0 0 N009 0 XOR vhigh=5
A§sig_B 0 N010 0 N021 0 0 N019 0 XOR vhigh=5
A§sig_C 0 N021 0 N033 0 0 N032 0 XOR vhigh=5
A§sig_D 0 N033 0 N051 0 0 N049 0 XOR vhigh=5
A§sig_E 0 N051 0 N061 0 0 N057 0 XOR vhigh=5
A§sig_F 0 N061 0 N068 0 0 N067 0 XOR vhigh=5
A§sig_G 0 N068 0 N072 0 0 N071 0 XOR vhigh=5
D2 N009 Y D
D1 N009 X D
D3 N009 Z D
D4 N019 X D
D5 N019 Y D
D7 N032 Z D
D8 N049 X D
D10 N057 Z D
D9 N057 Y D
D11 N032 X D
D6 N067 Y D
D12 N071 Z D
R9 Z 0 10k
R10 X 0 10k
R12 Y 0 10k
R11 Vdd N016 680
R13 N016 N027 680
R14 N027 N041 680
R15 N041 N053 680
R16 N053 N065 680
R17 N065 N070 680
R18 N070 N074 680
R19 N074 0 680
XA_SIG TEST N016 Vdd 0 N017 level.2 Avol=1Meg GBW=10Meg Slew=10Meg ilimit=25m rail=0 Vos=0 phimargin=45 en=0 enk=0 in=0 ink=0 Rin=500Meg  ; pins IN+ IN- V+ V- OUT
XB_SIG TEST N027 Vdd 0 N022 level.2 Avol=1Meg GBW=10Meg Slew=10Meg ilimit=25m rail=0 Vos=0 phimargin=45 en=0 enk=0 in=0 ink=0 Rin=500Meg  ; pins IN+ IN- V+ V- OUT
XC_SIG TEST N041 Vdd 0 N025 level.2 Avol=1Meg GBW=10Meg Slew=10Meg ilimit=25m rail=0 Vos=0 phimargin=45 en=0 enk=0 in=0 ink=0 Rin=500Meg  ; pins IN+ IN- V+ V- OUT
XD_SIG TEST N053 Vdd 0 N028 level.2 Avol=1Meg GBW=10Meg Slew=10Meg ilimit=25m rail=0 Vos=0 phimargin=45 en=0 enk=0 in=0 ink=0 Rin=500Meg  ; pins IN+ IN- V+ V- OUT
XE_SIG TEST N065 Vdd 0 N037 level.2 Avol=1Meg GBW=10Meg Slew=10Meg ilimit=25m rail=0 Vos=0 phimargin=45 en=0 enk=0 in=0 ink=0 Rin=500Meg  ; pins IN+ IN- V+ V- OUT
XF_SIG TEST N070 Vdd 0 N050 level.2 Avol=1Meg GBW=10Meg Slew=10Meg ilimit=25m rail=0 Vos=0 phimargin=45 en=0 enk=0 in=0 ink=0 Rin=500Meg  ; pins IN+ IN- V+ V- OUT
XG_SIG TEST N074 Vdd 0 N066 level.2 Avol=1Meg GBW=10Meg Slew=10Meg ilimit=25m rail=0 Vos=0 phimargin=45 en=0 enk=0 in=0 ink=0 Rin=500Meg  ; pins IN+ IN- V+ V- OUT
A11 N017 N022 N025 N028 0 0 N023 0 OR vhigh=5
A§Y_SIGNAL N017 N022 N035 N038 0 0 N034 0 OR vhigh=5
A§Z_SIGNAL 0 N055 N058 N059 0 0 N056 0 OR vhigh=5
A§C_invert N025 0 0 0 0 N043 0 0 BUF vhigh=5
A§D_invert N028 0 0 0 0 N046 0 0 BUF vhigh=5
A10 0 N037 0 N042 0 0 N035 0 AND vhigh=5
A12 N042 0 N050 0 0 0 N038 0 AND vhigh=5
A§B_inv N022 0 0 0 0 N060 0 0 BUF vhigh=5
A§D_inv N028 0 0 0 0 N062 0 0 BUF vhigh=5
A§F_inv N050 0 0 0 0 N063 0 0 BUF vhigh=5
A25 N060 N062 N063 N066 0 0 N059 0 AND vhigh=5
A26 N060 N062 0 0 0 0 N058 0 AND vhigh=5
A27 0 0 0 N060 0 0 N055 0 AND vhigh=5
A§CD_inv N043 0 0 N046 0 0 N042 0 AND vhigh=5
A§X0 A0 0 B0 0 0 0 N075 0 AND vhigh=5
A9 N076 A0 B1 0 0 0 N077 0 AND vhigh=5
A13 N078 A1 B0 0 0 0 N079 0 AND vhigh=5
A14 N081 A1 B0 0 0 0 N082 0 AND vhigh=5
A15 A0 B1 B0 0 0 0 N083 0 AND vhigh=5
A16 N084 A1 B1 0 0 0 N085 0 AND vhigh=5
A17 N088 A1 B1 0 0 0 N087 0 AND vhigh=5
A§X3 A1 A0 B1 B0 0 0 N089 0 AND vhigh=5
A§X1 N077 N079 0 N082 N083 0 N080 0 OR vhigh=5
A§X2 0 N085 0 N087 0 0 N086 0 OR vhigh=5
A§inverted A1 0 0 0 0 N076 0 0 BUF vhigh=5
A§inverted1 A0 0 0 0 0 N078 0 0 BUF vhigh=5
A§inverted2 B1 0 0 0 0 N081 0 0 BUF vhigh=5
A§inverted3 A0 0 0 0 0 N084 0 0 BUF vhigh=5
A§inverted4 B0 0 0 0 0 N088 0 0 BUF vhigh=5
V1 A1 0 0
V2 A0 0 0
V3 B1 0 5
V4 B0 0 5
.model D D
.lib standard.dio
.tran 0 10m 0 1m
* Y = S0' S1' S2' X0 + S0 S1' S2' X1 + S0' S1 S2' X2 + S0 S1 S2' X3 + S0' S1' S2 X4 + S0 S1' S2 X5 + S0' S1 S2 X6 + S0 S1 S2 X7
* 𝑍 = 𝐴 + 𝐵′𝐶 + 𝐵′ 𝐷′ 𝐸 + 𝐵′ 𝐷′ 𝐹′ 𝐺
* 𝑌=𝐴+𝐵+𝐶′ 𝐷′ 𝐸+𝐶′ 𝐷′ 𝐹
* X = A + B + C + D
* A
* B
* C
* D
* E
* F
* G
* A
* B
* C
* D
* E
* F
* G
.lib UniversalOpamps2.sub
.backanno
.end